# EAGLE design soil_mite_v1 (EAGLE 6.5.0)
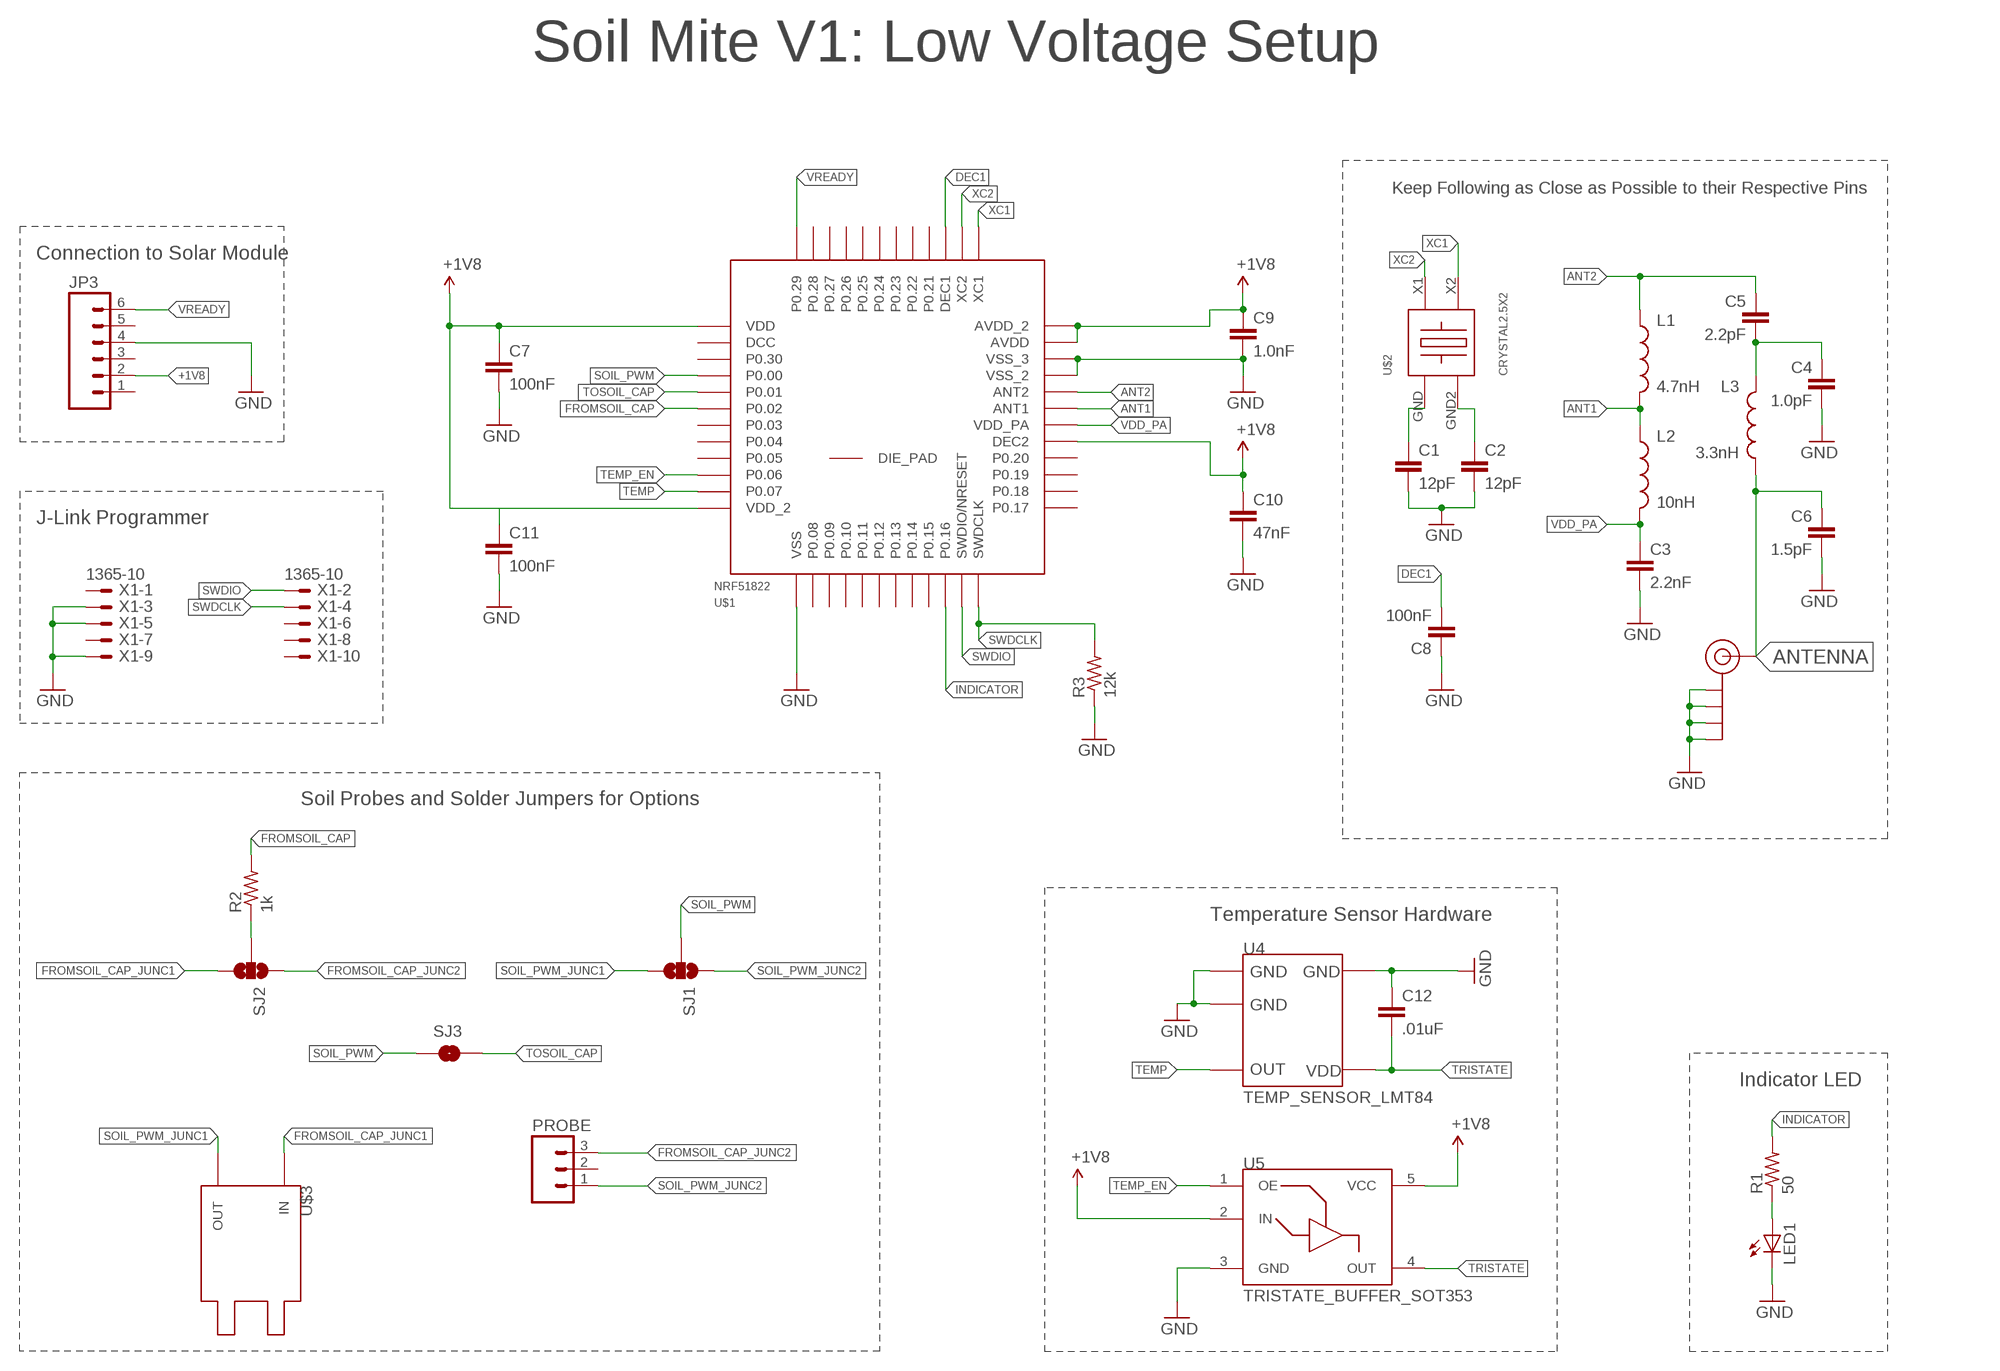
[diagram p0: schematic, sheet 1]

## Parts
C1  12pF  CAP0402-CAP  [0402-CAP]
C2  12pF  CAP0402-CAP  [0402-CAP]
C3  2.2nF  CAP0402-CAP  [0402-CAP]
C4  1.0pF  CAP0402-CAP  [0402-CAP]
C5  2.2pF  CAP0402-CAP  [0402-CAP]
C6  1.5pF  CAP0402-CAP  [0402-CAP]
C7  100nF  CAP0402-CAP  [0402-CAP]
C8  100nF  CAP0402-CAP  [0402-CAP]
C9  1.0nF  CAP0402-CAP  [0402-CAP]
C10  47nF  CAP0402-CAP  [0402-CAP]
C11  100nF  CAP0402-CAP  [0402-CAP]
C12  .01uF  CAP0402-CAP  [0402-CAP]
J$1  SMA_EDGE  [SMA-EDGE]
JP3  M06POLAR  [MOLEX-1X6]
L1  4.7nH  INDUCTOR0402  [C0402]
L2  10nH  INDUCTOR0402  [C0402]
L3  3.3nH  INDUCTOR0402  [C0402]
LED1  JON_LIB_LEDCHIPLED_0603  [JON_LIB_CHIPLED_0603]
PROBE  M03PTH  [1X03]
R1  50  R-US_R0603  [R0603]
R2  1k  R-US_R0603  [R0603]
R3  12k  RCL_R-US_R0402  [RCL_R0402]
SJ1  SOLDERJUMPER_2WAYT  [SJ_2]
SJ2  SOLDERJUMPER_2WAYT  [SJ_2]
SJ3  SOLDERJUMPERNO  [SJ_2S-NO]
U4  TEMP_SENSOR_LMT84  [SOT353]
U5  TRISTATE_BUFFER_SOT353  [SOT353]
U$1  NRF51822  [QFN48]
U$2  CRYSTAL2.5X2  [2.5X2MM]
U$3  SOIL_PROBE_TOP_TOPOUT-IN  [PROBE_LAYOUT_1_OUT-IN]
X1  1365-10  [1365-10]

## Nets
+1V8: C7.1 C9.1 C10.1 C11.1 JP3.2 U5.2(IN) U5.5(VCC) U$1.1(VDD) U$1.12(VDD_2) U$1.29(DEC2) U$1.35(AVDD) U$1.36(AVDD_2)
ANT1: L1.2 L2.1 U$1.31(ANT1)
ANT2: C5.1 L1.1 U$1.32(ANT2)
ANTENNA: C6.1 J$1.SIG(SIGNAL) L3.2
DEC1: C8.2 U$1.39(DEC1)
FROMSOIL_CAP: R2.1 R2.2 SJ2.2 U$1.6(P0.02)
FROMSOIL_CAP_JUNC1: SJ2.3 U$3.IN
FROMSOIL_CAP_JUNC2: PROBE.3 SJ2.1
GND: C1.2 C2.2 C3.2 C4.2 C6.2 C7.2 C8.1 C9.2 C10.2 C11.2 C12.1 J$1.GND@0(GND) J$1.GND@1(GND) J$1.GND@2(GND) J$1.GND@3(GND) JP3.4 LED1.C R3.1 U4.1(GND) U4.2(GND) U4.5(GND) U5.3(GND) U$1.13(VSS) U$1.33(VSS_2) U$1.34(VSS_3) X1.3 X1.5 X1.9
INDICATOR: R1.2 U$1.22(P0.16)
N$2: C1.1 U$2.GND
N$4: C2.1 U$2.GND2
N$5: LED1.A R1.1
N$9: C4.1 C5.2 L3.1
SOIL_PWM: SJ1.2 SJ3.1 U$1.4(P0.00)
SOIL_PWM_JUNC1: SJ1.3 U$3.OUT
SOIL_PWM_JUNC2: PROBE.1 SJ1.1
SWDCLK: R3.2 U$1.24(SWDCLK) X1.4
SWDIO: U$1.23(SWDIO/NRESET) X1.2
TEMP: U4.3(OUT) U$1.11(P0.07)
TEMP_EN: U5.1(OE) U$1.10(P0.06)
TOSOIL_CAP: SJ3.2 U$1.5(P0.01)
TRISTATE: C12.2 U4.4(VDD) U5.4(OUT)
VDD_PA: C3.1 L2.2 U$1.30(VDD_PA)
VREADY: JP3.6 U$1.48(P0.29)
XC1: U$1.37(XC1) U$2.X2
XC2: U$1.38(XC2) U$2.X1
Unconnected: JP3.1 JP3.3 JP3.5 PROBE.2 U$1.2(DCC) U$1.3(P0.30) U$1.7(P0.03) U$1.8(P0.04) U$1.9(P0.05) U$1.14(P0.08) U$1.15(P0.09) U$1.16(P0.10) U$1.17(P0.11) U$1.18(P0.12) U$1.19(P0.13) U$1.20(P0.14) U$1.21(P0.15) U$1.25(P0.17) U$1.26(P0.18) U$1.27(P0.19) U$1.28(P0.20) U$1.40(P0.21) U$1.41(P0.22) U$1.42(P0.23) U$1.43(P0.24) U$1.44(P0.25) U$1.45(P0.26) U$1.46(P0.27) U$1.47(P0.28) U$1.GND(DIE_PAD) X1.1 X1.6 X1.7 X1.8 X1.10

## Notes on the sheet
- Soil Mite V1: Low Voltage Setup
- Keep Following as Close as Possible to their Respective Pins
- Connection to Solar Module
- J-Link Programmer
- Soil Probes and Solder Jumpers for Options
- Temperature Sensor Hardware
- Indicator LED

## Library data of the parts
C1-C12 = SparkFun-Capacitors:CAP: Capacitor Standard 0603 ceramic capacitor, and 0.1" leaded capacitor.
J$1 = SparkFun-Connectors:SMA_EDGE: SMA Antenna Connector End launch SMA connector. The paste layer has been removed so that the connector can be hand soldered onto the board after reflow.
JP3 = SparkFun-Connectors:M06: Header 6 Standard 6-pin 0.1" header. Use with straight break away headers (SKU : PRT-00116), right angle break away headers (PRT-00553), swiss pins (PRT-00743), machine pins (PRT-00117), and female headers (PRT-00115). Molex polarized connector foot print use with SKU : PRT-08094 with associated crimp pins and housings. NOTES ON THE VARIANTS LOCK and LOCK_LONGPADS... This footprint was designed to help hold the alignment of a through-hole component (i.e. 6-pin header) while soldering it into place. You may notice that each hole has been shifted either up or down by 0.005 of an inch from it's more standard position (which is a perfectly straight line). This slight alteration caused the pins (the squares in the middle) to touch the edges of the holes. Because they are alternating, it causes a "brace" to hold the component in place. 0.005 has proven to be the perfect amount of "off-center" position when using our standard breakaway headers. Although looks a little odd when you look at the bare footprint, once you have a header in there, the alteration is very hard to notice. Also,if you push a header all the way into place, it is covered up entirely on the bottom side. This idea of altering the position of holes to aid alignment will be further integrated into the Sparkfun Library for other footprints. It can help hold any component with 3 or more connection pins.
L1-L3 = SparkFun-Passives:INDUCTOR: Inductors Basic Inductor/Choke - 0603 and 1206. Footprints are not proven and vary greatly between part numbers. SRN6045- 33uH, 20% 1.4A SDR0403-560KL - 56uH, 10%, 500mA RMS/740mA peak
LED1 = MAAV_13v1:JON_LIB_LED: LED OSRAM: - CHIPLED LG R971, LG N971, LY N971, LG Q971, LY Q971, LO R971, LY R971 LH N974, LH R974 LS Q976, LO Q976, LY Q976 LO Q996 - Hyper CHIPLED LW Q18S LB Q993, LB Q99A, LB R99A - SideLED LS A670, LO A670, LY A670, LG A670, LP A670 LB A673, LV A673, LT A673, LW A673 LH A674 LY A675 LS A676, LA A676, LO A676, LY A676, LW A676 LS A679, LY A679, LG A679 - Hyper Micro SIDELED® LS Y876, LA Y876, LO Y876, LY Y876 LT Y87S - SmartLED LW L88C, LW L88S LB L89C, LB L89S, LG L890 LS L89K, LO L89K, LY L89K LS L896, LA L896, LO L896, LY L896 - TOPLED LS T670, LO T670, LY T670, LG T670, LP T670 LSG T670, LSP T670, LSY T670, LOP T670, LYG T670 LG T671, LOG T671, LSG T671 LB T673, LV T673, LT T673, LW T673 LH T674 LS T676, LA T676, LO T676, LY T676, LB T676, LH T676, LSB T676, LW T676 LB T67C, LV T67C, LT T67C, LS T67K, LO T67K, LY T67K, LW E67C LS E67B, LA E67B, LO E67B, LY E67B, LB E67C, LV E67C, LT E67C LW T67C LS T679, LY T679, LG T679 LS T770, LO T770, LY T770, LG T770, LP T770 LB T773, LV T773, LT T773, LW T773 LH T774 LS E675, LA E675, LY E675, LS T675 LS T776, LA T776, LO T776, LY T776, LB T776 LHGB T686 LT T68C, LB T68C - Hyper Mini TOPLED® LB M676 - Mini TOPLED Santana® LG M470 LS M47K, LO M47K, LY M47K Source: http://www.osram.convergy.de LUXEON: - LUMILED® LXK2-PW12-R00, LXK2-PW12-S00, LXK2-PW14-U00, LXK2-PW14-V00 LXK2-PM12-R00, LXK2-PM12-S00, LXK2-PM14-U00 LXK2-PE12-Q00, LXK2-PE12-R00, LXK2-PE12-S00, LXK2-PE14-T00, LXK2-PE14-U00 LXK2-PB12-K00, LXK2-PB12-L00, LXK2-PB12-M00, LXK2-PB14-N00, LXK2-PB14-P00, LXK2-PB14-Q00 LXK2-PR12-L00, LXK2-PR12-M00, LXK2-PR14-Q00, LXK2-PR14-R00 LXK2-PD12-Q00, LXK2-PD12-R00, LXK2-PD12-S00 LXK2-PH12-R00, LXK2-PH12-S00 LXK2-PL12-P00, LXK2-PL12-Q00, LXK2-PL12-R00 Source: www.luxeon.com KINGBRIGHT: KA-3528ASYC Source: www.kingbright.com
PROBE = SparkFun-Connectors:M03: Header 3 Standard 3-pin 0.1" header. Use with straight break away headers (SKU : PRT-00116), right angle break away headers (PRT-00553), swiss pins (PRT-00743), machine pins (PRT-00117), and female headers (PRT-00115). Molex polarized connector foot print use with SKU : PRT-08232 with associated crimp pins and housings.
R1 R2 = resistor:R-US_: RESISTOR, American symbol
R3 = MAAV_13v1:RCL_R-US_: RESISTOR, American symbol
SJ1 SJ2 = SparkFun-Passives:SOLDERJUMPER_2WAY: Solder Jumper 2 way solder jumper
SJ3 = SparkFun-Passives:SOLDERJUMPER: Solder Jumper Standard SMD solder jumper. Used to automate production. Two varients : Normally Open and Normally Closed are the same, but have different paste layers. NC will have a large amount of paste and should jumper during reflow.
U4 = soil_monitor:TEMP_SENSOR_LMT84
U5 = soil_monitor:TRISTATE_BUFFER_SOT353
U$1 = NordicSemi:NRF51822: Bluetooth 4.0 Low Energy/2.4Ghz NORDIC SEMICONDUCTOR
U$2 = NordicSemi:CRYSTAL2.5X2: Crystal 16.00MHz 8pF SMD Size Dimension: 2.5mm x 2.00mm Package: 4-SMD
U$3 = soil_monitor:SOIL_PROBE_TOP_TOP
X1 = con-leotronics:1365-10: DUAL ROW STRAIGHT HEADER 1364 SERIES. 1.27mm x 1.27mm. Without Fixing Post. SMT Source: http://www.leotronics.co.uk/Conexcon/Data%20Sheets/sec.%20A/1364ing.pdf; OC_FARNELL: unknown; OC_NEWARK: unknown

## Board
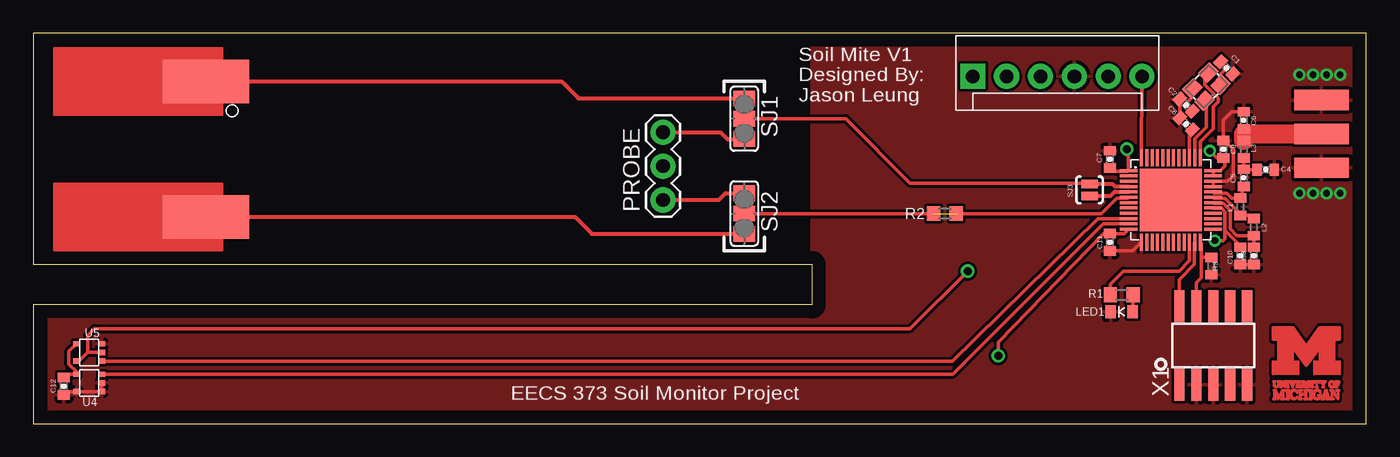
[diagram p1: board, top side]
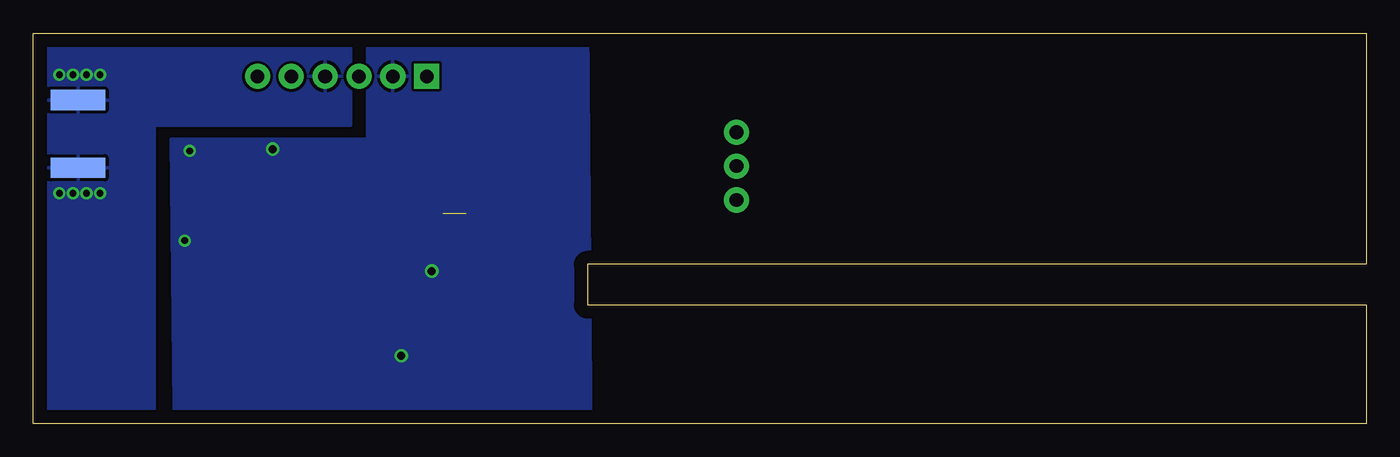
[diagram p2: board, bottom side, seen from below]

Size 100 x 29.26 mm. Coordinates in mm from the lower left corner, seen from the top.
Outline: 0,0 100,0 100,29.26 0,29.26 0,11.94 58.42,11.94 58.42,8.89 0,8.89 0,0
Copper layers (1*2*3*16): Top 0.035mm / dielectric 0.5mm / Route2 0.035mm / dielectric 0.5mm / Route3 0.035mm / dielectric 0.5mm / Bottom 0.035mm
Design rules "default *": minimum track width 10mil, minimum drill 24mil, track to track 8mil, track to pad 8mil, pad to pad 8mil, via to via 8mil, smd to smd 8mil, copper to edge 40mil, drill to drill 8mil, minimum pad ring 10mil, minimum via ring 8mil, stop-mask expansion 4mil, vias tented up to drill 0mil, thermal gap 10mil

### Footprints (pad centres in the part's own frame; a part is rotated, then mirrored left to right if it is on the bottom)
0402-CAP = smd 0.7 x 0.9: 1 -0.65,0; 2 0.65,0
SMA-EDGE = smd 1.524 x 4.064: GND@0 0,0; GND@1 5.08,0; SIG 2.54,0 | smd 1.524 x 4.064 bottom: GND@2 0,0; GND@3 5.08,0
MOLEX-1X6 = drill 1.016 pad 1.88 square: 1 0,0 | drill 1.016 pad 1.88: 2 2.54,0; 3 5.08,0; 4 7.62,0; 5 10.16,0; 6 12.7,0
C0402 = smd 0.7 x 0.9: 1 -0.65,0; 2 0.65,0
JON_LIB_CHIPLED_0603 = smd 0.8 x 1: A -0.825,0; C 0.825,0
1X03 = drill 1.016 pad 1.88: 1 0,0; 2 2.54,0; 3 5.08,0
R0603 = smd 1 x 1.1: 1 -0.85,0; 2 0.85,0
RCL_R0402 = smd 0.7 x 0.9: 1 -0.65,0; 2 0.65,0
SJ_2 = smd 1.168 x 1.6: 1 -1.524,0; 2 0,0; 3 1.524,0
SJ_2S-NO = smd 0.635 x 1.27: 1 -0.45,0; 2 0.45,0
SOT353 = smd 0.5 x 0.4: 1 -0.95,0.65; 2 -0.95,0; 3 -0.95,-0.65; 4 0.95,-0.65; 5 0.95,0.65
QFN48 = smd 1.3 x 0.226: 1 -3.17,2.2; 2 -3.17,1.8; 3 -3.17,1.4; 4 -3.17,1; 5 -3.17,0.6; 6 -3.17,0.2; 7 -3.17,-0.2; 8 -3.17,-0.6; 9 -3.17,-1; 10 -3.17,-1.4; 11 -3.17,-1.8; 12 -3.17,-2.2; 25 3.17,-2.2; 26 3.17,-1.8; 27 3.17,-1.4; 28 3.17,-1; 29 3.17,-0.6; 30 3.17,-0.2; 31 3.17,0.2; 32 3.17,0.6; 33 3.17,1; 34 3.17,1.4; 35 3.17,1.8; 36 3.17,2.2 | smd 0.226 x 1.3: 13 -2.2,-3.17; 14 -1.8,-3.17; 15 -1.4,-3.17; 16 -1,-3.17; 17 -0.6,-3.17; 18 -0.2,-3.17; 19 0.2,-3.17; 20 0.6,-3.17; 21 1,-3.17; 22 1.4,-3.17; 23 1.8,-3.17; 24 2.2,-3.17; 37 2.2,3.17; 38 1.8,3.17; 39 1.4,3.17; 40 1,3.17; 41 0.6,3.17; 42 0.2,3.17; 43 -0.2,3.17; 44 -0.6,3.17; 45 -1,3.17; 46 -1.4,3.17; 47 -1.8,3.17; 48 -2.2,3.17 | smd 4.66 x 4.66: GND 0,0
2.5X2MM = smd 1.2 x 1: GND 0.85,-0.65; GND2 -0.85,0.65; X1 -0.85,-0.65; X2 0.85,0.65
PROBE_LAYOUT_1_OUT-IN = smd 3.251 x 6.452: IN 5.08,5.08; OUT -5.08,5.08
1365-10 = smd 0.76 x 2.4: 1 -2.54,-2.95; 2 -2.54,2.95; 3 -1.27,-2.95; 4 -1.27,2.95; 5 0,-2.95; 6 0,2.95; 7 1.27,-2.95; 8 1.27,2.95; 9 2.54,-2.95; 10 2.54,2.95

### Placement (x,y rotation side)
C1  89.53,26.67 315 top
C2  86.49,23.88 135 top
C3  91.57,12.57 270 top
C4  92.46,19.05 0 top
C5  90.81,18.41 90 top
C6  90.81,22.73 90 top
C7  80.77,19.81 90 top
C8  86.49,22.48 315 top
C9  89.28,20.57 90 top
C10  90.55,12.57 270 top
C11  80.77,13.59 270 top
C12  2.29,2.79 90 top
J$1  96.65,24.26 270 top
JP3  70.48,26.04 0 top
L1  90.55,16.26 270 top
L2  91.57,14.73 270 top
L3  90.81,20.57 90 top
LED1  81.66,8.38 180 top
PROBE  47.24,21.84 270 top
R1  81.66,9.65 180 top
R2  68.39,15.75 180 top
R3  88.39,11.81 90 top
SJ1  53.34,22.86 90 top
SJ2  53.34,15.75 270 top
SJ3  79.25,17.53 270 top
U4  4.19,3.05 180 top
U5  4.19,5.33 180 top
U$1  85.34,16.76 0 top
U$2  88.01,25.27 45 top
U$3  7.87,20.57 270 top
U$5  [BLOCK-M-DOUBLE-STACKED-5MM_MASK]  95.5,4.32 0 top
X1  88.52,5.84 0 top

### Tracks (layer width: path | path; a pad name or v marks a point on that pad's centre or on a via)
+1V8  (via drill 0.5, 0.6)
  Top 0.254: C10.1 90.55,13.34 89.41,14.48 | 89.41,14.48 89.41,15.88 89.15,16.13 88.55,16.13 U$1.29 | U5.5 3.41,4.68 4.06,5.33 | 4.06,5.33 4.06,6.6 4.57,7.11 65.79,7.11 v70.1,11.43 | 4.06,5.33 U5.2 | v72.39,5.08 72.39,6.1 80.28,14.24 C11.1 81.85,14.24 U$1.12 | U$1.35 U$1.36 89.07,18.96 89.41,19.3 89.41,19.8 C9.1 88.79,19.92 v88.27,20.45 | v82.04,20.57 82.17,19.94 U$1.1 82.13,18.92 81.15,18.92 80.91,19.16 C7.1 | 89.41,14.48 89.41,13.84 89.28,13.72 v88.65,13.72
  pour Bottom: 58.42,30.23 74.93,30.23 74.93,21.34 89.66,21.34 89.41,-2.29 58.17,-2.29
ANT1
  Top 0.254: L2.1 91.34,15.61 L1.2 90.55,15.75 89.41,16.89 88.59,16.89 U$1.31
ANT2
  Top 0.254: C5.1 L1.1 89.9,16.91 89.53,17.27 88.61,17.27 U$1.32
ANTENNA
  Top 0.406: C6.1 90.81,21.72
  Top 1.422: L3.2 90.81,21.72 J$1.SIG
DEC1
  Top 0.254: C8.2 86.74,21.82 U$1.39
FROMSOIL_CAP  (1 unrouted)
  Top 0.254: U$1.6 82.1,16.89 81.28,16.89 80.14,15.75 R2.1 | SJ2.2 R2.2
FROMSOIL_CAP_JUNC1
  Top 0.305: U$3.IN 40.64,15.49 41.91,14.22 SJ2.3
FROMSOIL_CAP_JUNC2
  Top 0.305: PROBE.3 51.44,16.76 51.94,17.27 SJ2.1
GND  (via drill 0.5)
  Top 0.254: C8.1 C2.2 | C11.2 82.49,12.94 U$1.13 | U$1.33 U$1.34 89.54,18.16 90.04,18.54 90.04,20.59 C9.2 89.28,22.73 89.92,23.37 90.54,23.37 C6.2 | C12.1 2.54,2.4 U4.5 U4.1 U4.2 | C10.2 C3.2
  other vias: 96.01,26.16 97.03,26.16 98.04,26.16 95,26.16 98.04,17.27 97.03,17.27 96.01,17.27 95,17.27
  pour Bottom: 90.93,-2.35 90.93,22.35 76.2,22.35 76.2,30.23 99.06,30.23 98.81,-2.35
  pour Top: 0.76,8.13 0.76,-2.54 98.81,-2.54 99.06,30.23 58.42,30.23 58.42,8.13
INDICATOR
  Top 0.254: R1.2 80.81,10.45 81.79,11.43 85.98,11.43 86.74,12.19 U$1.22
N$2
  Top 0.254: C1.1 89.41,26.8 89.41,26.54 89.07,26.21 U$2.GND
N$4
  Top 0.254: C2.1 86.61,23.75 86.61,24.13 86.95,24.47 U$2.GND2
N$5
  Top 0.254: R1.1 82.51,8.41 LED1.A
N$9
  Top 0.254: C4.1 90.57,19.05 C5.2 L3.1
SOIL_PWM
  Top 0.254: SJ1.2 60.96,22.86 65.79,18.03 79.19,18.03 SJ3.1
  Top 0.305: SJ3.1 80.96,17.98 81.15,17.78 82.16,17.78 U$1.4
SOIL_PWM_JUNC1
  Top 0.305: U$3.OUT 39.62,25.65 40.89,24.38 SJ1.3
SOIL_PWM_JUNC2
  Top 0.305: PROBE.1 51.56,21.84 52.07,21.34 SJ1.1
SWDCLK
  Top 0.254: 87.63,12.45 87.63,10.92 87.25,10.54 87.25,9.27 87.38,9.14 87.38,8.16 X1.4 | 87.63,12.45 87.63,13.51 U$1.24 | R3.2 87.64,12.46 87.63,12.45
SWDIO
  Top 0.254: X1.2 85.98,10.79 87.12,11.94 87.12,13.57 U$1.23
TEMP
  Top 0.254: U4.3 68.98,3.7 80.26,14.99 82.15,14.99 U$1.11
TEMP_EN
  Top 0.254: U5.1 68.95,4.68 79.88,15.37 U$1.10
TOSOIL_CAP
  Top 0.305: SJ3.2 80.83,17.08 81.15,17.4 82.14,17.4 U$1.5
TRISTATE
  Top 0.254: U5.4 2.67,5.41 2.67,4.45 3.24,3.87 U4.4 2.54,3.7 C12.2
VDD_PA
  Top 0.254: U$1.30 88.57,16.51 89.28,16.51 89.79,16 89.79,14.61 90.31,14.08 L2.2 C3.1
VREADY
  Top 0.254: JP3.6 83.13,19.95 U$1.48
XC1
  Top 0.254: U$1.37 87.54,21.12 88.52,22.1 88.52,23.75 88.9,24.13 88.9,24.38 87.88,25.4 87.88,26.07 U$2.X2
XC2
  Top 0.254: U$1.38 87.14,21.36 88.01,22.23 88.01,24.07 U$2.X1

### Text on the board
tPlace: Soil Mite V1 / Designed By: / Jason Leung | EECS 373 Soil Monitor Project